# EAGLE schematic marbles_v70 (EAGLE 9.6.2)

## Sheet 1 of 5
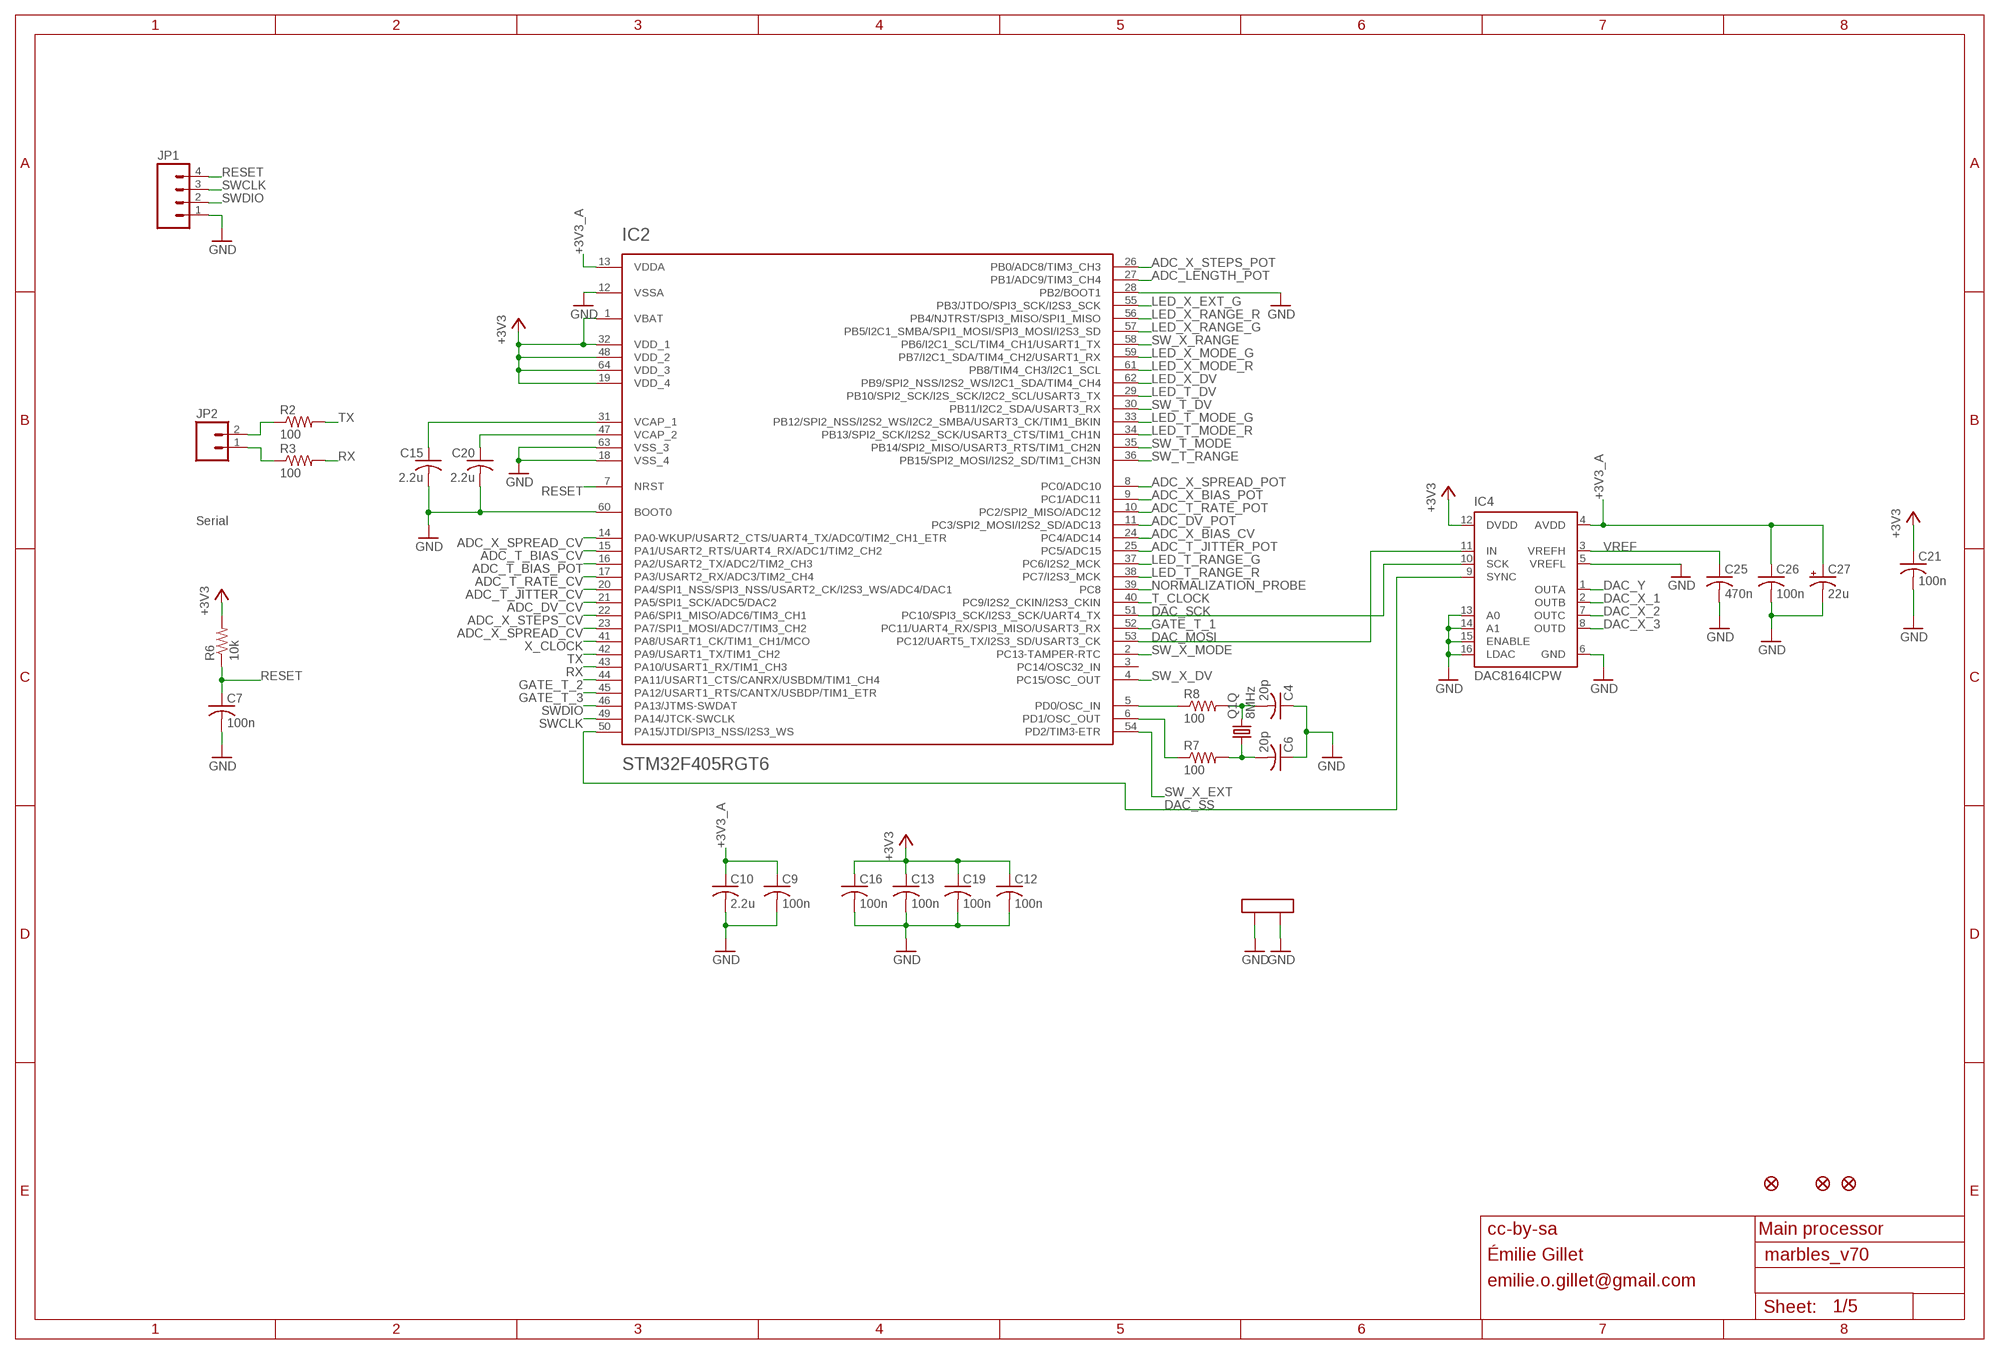
[diagram p0: schematic, sheet 1]

### Parts
C4  20p  C-USC0402  [C0402]
C6  20p  C-USC0402  [C0402]
C7  100n  C-USC0402  [C0402]
C9  100n  C-USC0402  [C0402]
C10  2.2u  C-USC0805  [C0805]
C12  100n  C-USC0402  [C0402]
C13  100n  C-USC0402  [C0402]
C15  2.2u  C-USC0805  [C0805]
C16  100n  C-USC0402  [C0402]
C19  100n  C-USC0402  [C0402]
C20  2.2u  C-USC0805  [C0805]
C21  100n  C-USC0402  [C0402]
C25  470n  C-USC0402  [C0402]
C26  100n  C-USC0402  [C0402]
C27  22u  CPOL-USC  [PANASONIC_C]
F1  FIDUCIAL1X2  [FIDUCIAL-1X2]
F2  FIDUCIAL1X2  [FIDUCIAL-1X2]
F3  FIDUCIAL1X2  [FIDUCIAL-1X2]
IC2  STM32F405RGT6  STM32F20X  [TQFP-10X10-64]
IC4  DAC8164ICPW  DAC8564  [SOP65P640X110-16N]
JP1  M04PTH  [1X04]
JP2  M02PTH  [1X02]
Q1  8MHz  CRYSTAL  [CTS406]
R2  100  R-US_R0402  [R0402]
R3  100  R-US_R0402  [R0402]
R6  10k  R-US_R0402  [R0402]
R7  100  R-US_R0402  [R0402]
R8  100  R-US_R0402  [R0402]

### Nets
+3V3: C12.1 C13.1 C16.1 C19.1 C21.1 IC2.1(VBAT) IC2.19(VDD_4) IC2.32(VDD_1) IC2.48(VDD_2) IC2.64(VDD_3) IC4.12(DVDD) R6.2 ; also sheet 3,5
+3V3_A: C9.1 C10.1 C26.1 C27.+ IC2.13(VDDA) IC4.4(AVDD) ; also sheet 2,3,5
ADC_DV_CV: IC2.21(PA5/SPI1_SCK/ADC5/DAC2) ; also sheet 3
ADC_DV_POT: IC2.11(PC3/SPI2_MOSI/I2S2_SD/ADC13) ; also sheet 2
ADC_LENGTH_POT: IC2.27(PB1/ADC9/TIM3_CH4) ; also sheet 2
ADC_T_BIAS_CV: IC2.15(PA1/USART2_RTS/UART4_RX/ADC1/TIM2_CH2) ; also sheet 3
ADC_T_BIAS_POT: IC2.16(PA2/USART2_TX/ADC2/TIM2_CH3) ; also sheet 2
ADC_T_JITTER_CV: IC2.20(PA4/SPI1_NSS/SPI3_NSS/USART2_CK/I2S3_WS/ADC4/DAC1) ; also sheet 3
ADC_T_JITTER_POT: IC2.25(PC5/ADC15) ; also sheet 2
ADC_T_RATE_CV: IC2.17(PA3/USART2_RX/ADC3/TIM2_CH4) ; also sheet 3
ADC_T_RATE_POT: IC2.10(PC2/SPI2_MISO/ADC12) ; also sheet 2
ADC_X_BIAS_CV: IC2.24(PC4/ADC14) ; also sheet 3
ADC_X_BIAS_POT: IC2.9(PC1/ADC11) ; also sheet 2
ADC_X_SPREAD_CV: IC2.14(PA0-WKUP/USART2_CTS/UART4_TX/ADC0/TIM2_CH1_ETR) IC2.23(PA7/SPI1_MOSI/ADC7/TIM3_CH2) ; also sheet 3
ADC_X_SPREAD_POT: IC2.8(PC0/ADC10) ; also sheet 2
ADC_X_STEPS_CV: IC2.22(PA6/SPI1_MISO/ADC6/TIM3_CH1) ; also sheet 3
ADC_X_STEPS_POT: IC2.26(PB0/ADC8/TIM3_CH3) ; also sheet 2
DAC_MOSI: IC2.53(PC12/UART5_TX/I2S3_SD/USART3_CK) IC4.11(IN)
DAC_SCK: IC2.51(PC10/SPI3_SCK/I2S3_SCK/UART4_TX) IC4.10(SCK)
DAC_SS: IC2.50(PA15/JTDI/SPI3_NSS/I2S3_WS) IC4.9(SYNC)
DAC_X_1: IC4.2(OUTB) ; also sheet 4
DAC_X_2: IC4.7(OUTC) ; also sheet 4
DAC_X_3: IC4.8(OUTD) ; also sheet 4
DAC_Y: IC4.1(OUTA) ; also sheet 4
GATE_T_1: IC2.52(PC11/UART4_RX/SPI3_MISO/USART3_RX) ; also sheet 4
GATE_T_2: IC2.44(PA11/USART1_CTS/CANRX/USBDM/TIM1_CH4) ; also sheet 4
GATE_T_3: IC2.45(PA12/USART1_RTS/CANTX/USBDP/TIM1_ETR) ; also sheet 4
GND: C4.1 C6.1 C7.2 C9.2 C10.2 C12.2 C13.2 C15.2 C16.2 C19.2 C20.2 C21.2 C25.2 C26.2 C27.- IC2.12(VSSA) IC2.18(VSS_4) IC2.28(PB2/BOOT1) IC2.60(BOOT0) IC2.63(VSS_3) IC4.5(VREFL) IC4.6(GND) IC4.13(A0) IC4.14(A1) IC4.15(ENABLE) IC4.16(LDAC) JP1.1 Q1.2(LID1) Q1.4(LID2) ; also sheet 2,3,4,5
LED_T_DV: IC2.29(PB10/SPI2_SCK/I2S_SCK/I2C2_SCL/USART3_TX) ; also sheet 2
LED_T_MODE_G: IC2.33(PB12/SPI2_NSS/I2S2_WS/I2C2_SMBA/USART3_CK/TIM1_BKIN) ; also sheet 2
LED_T_MODE_R: IC2.34(PB13/SPI2_SCK/I2S2_SCK/USART3_CTS/TIM1_CH1N) ; also sheet 2
LED_T_RANGE_G: IC2.37(PC6/I2S2_MCK) ; also sheet 2
LED_T_RANGE_R: IC2.38(PC7/I2S3_MCK) ; also sheet 2
LED_X_DV: IC2.62(PB9/SPI2_NSS/I2S2_WS/I2C1_SDA/TIM4_CH4) ; also sheet 2
LED_X_EXT_G: IC2.55(PB3/JTDO/SPI3_SCK/I2S3_SCK) ; also sheet 2
LED_X_MODE_G: IC2.59(PB7/I2C1_SDA/TIM4_CH2/USART1_RX) ; also sheet 2
LED_X_MODE_R: IC2.61(PB8/TIM4_CH3/I2C1_SCL) ; also sheet 2
LED_X_RANGE_G: IC2.57(PB5/I2C1_SMBA/SPI1_MOSI/SPI3_MOSI/I2S3_SD) ; also sheet 2
LED_X_RANGE_R: IC2.56(PB4/NJTRST/SPI3_MISO/SPI1_MISO) ; also sheet 2
N$7: IC2.6(PD1/OSC_OUT) R7.1
N$8: IC2.5(PD0/OSC_IN) R8.1
N$13: C20.1 IC2.47(VCAP_2)
N$19: C15.1 IC2.31(VCAP_1)
N$33: JP2.2 R2.1
N$51: JP2.1 R3.1
N$62: C4.2 Q1.3 R8.2
N$65: C6.2 Q1.1 R7.2
NORMALIZATION_PROBE: IC2.39(PC8) ; also sheet 3
RESET: C7.1 IC2.7(NRST) JP1.4 R6.1
RX: IC2.43(PA10/USART1_RX/TIM1_CH3) R3.2
SW_T_DV: IC2.30(PB11/I2C2_SDA/USART3_RX) ; also sheet 2
SW_T_MODE: IC2.35(PB14/SPI2_MISO/USART3_RTS/TIM1_CH2N) ; also sheet 2
SW_T_RANGE: IC2.36(PB15/SPI2_MOSI/I2S2_SD/TIM1_CH3N) ; also sheet 2
SW_X_DV: IC2.4(PC15/OSC_OUT) ; also sheet 2
SW_X_EXT: IC2.54(PD2/TIM3-ETR) ; also sheet 2
SW_X_MODE: IC2.2(PC13-TAMPER-RTC) ; also sheet 2
SW_X_RANGE: IC2.58(PB6/I2C1_SCL/TIM4_CH1/USART1_TX) ; also sheet 2
SWCLK: IC2.49(PA14/JTCK-SWCLK) JP1.3
SWDIO: IC2.46(PA13/JTMS-SWDAT) JP1.2
T_CLOCK: IC2.40(PC9/I2S2_CKIN/I2S3_CKIN) ; also sheet 3
TX: IC2.42(PA9/USART1_TX/TIM1_CH2) R2.2
VREF: C25.1 IC4.3(VREFH) ; also sheet 4
X_CLOCK: IC2.41(PA8/USART1_CK/TIM1_CH1/MCO) ; also sheet 3
Unconnected: IC2.3(PC14/OSC32_IN)

### Notes on the sheet
- Serial
- cc-by-sa | Main processor
- Émilie Gillet
- emilie.o.gillet@gmail.com

## Sheet 2 of 5
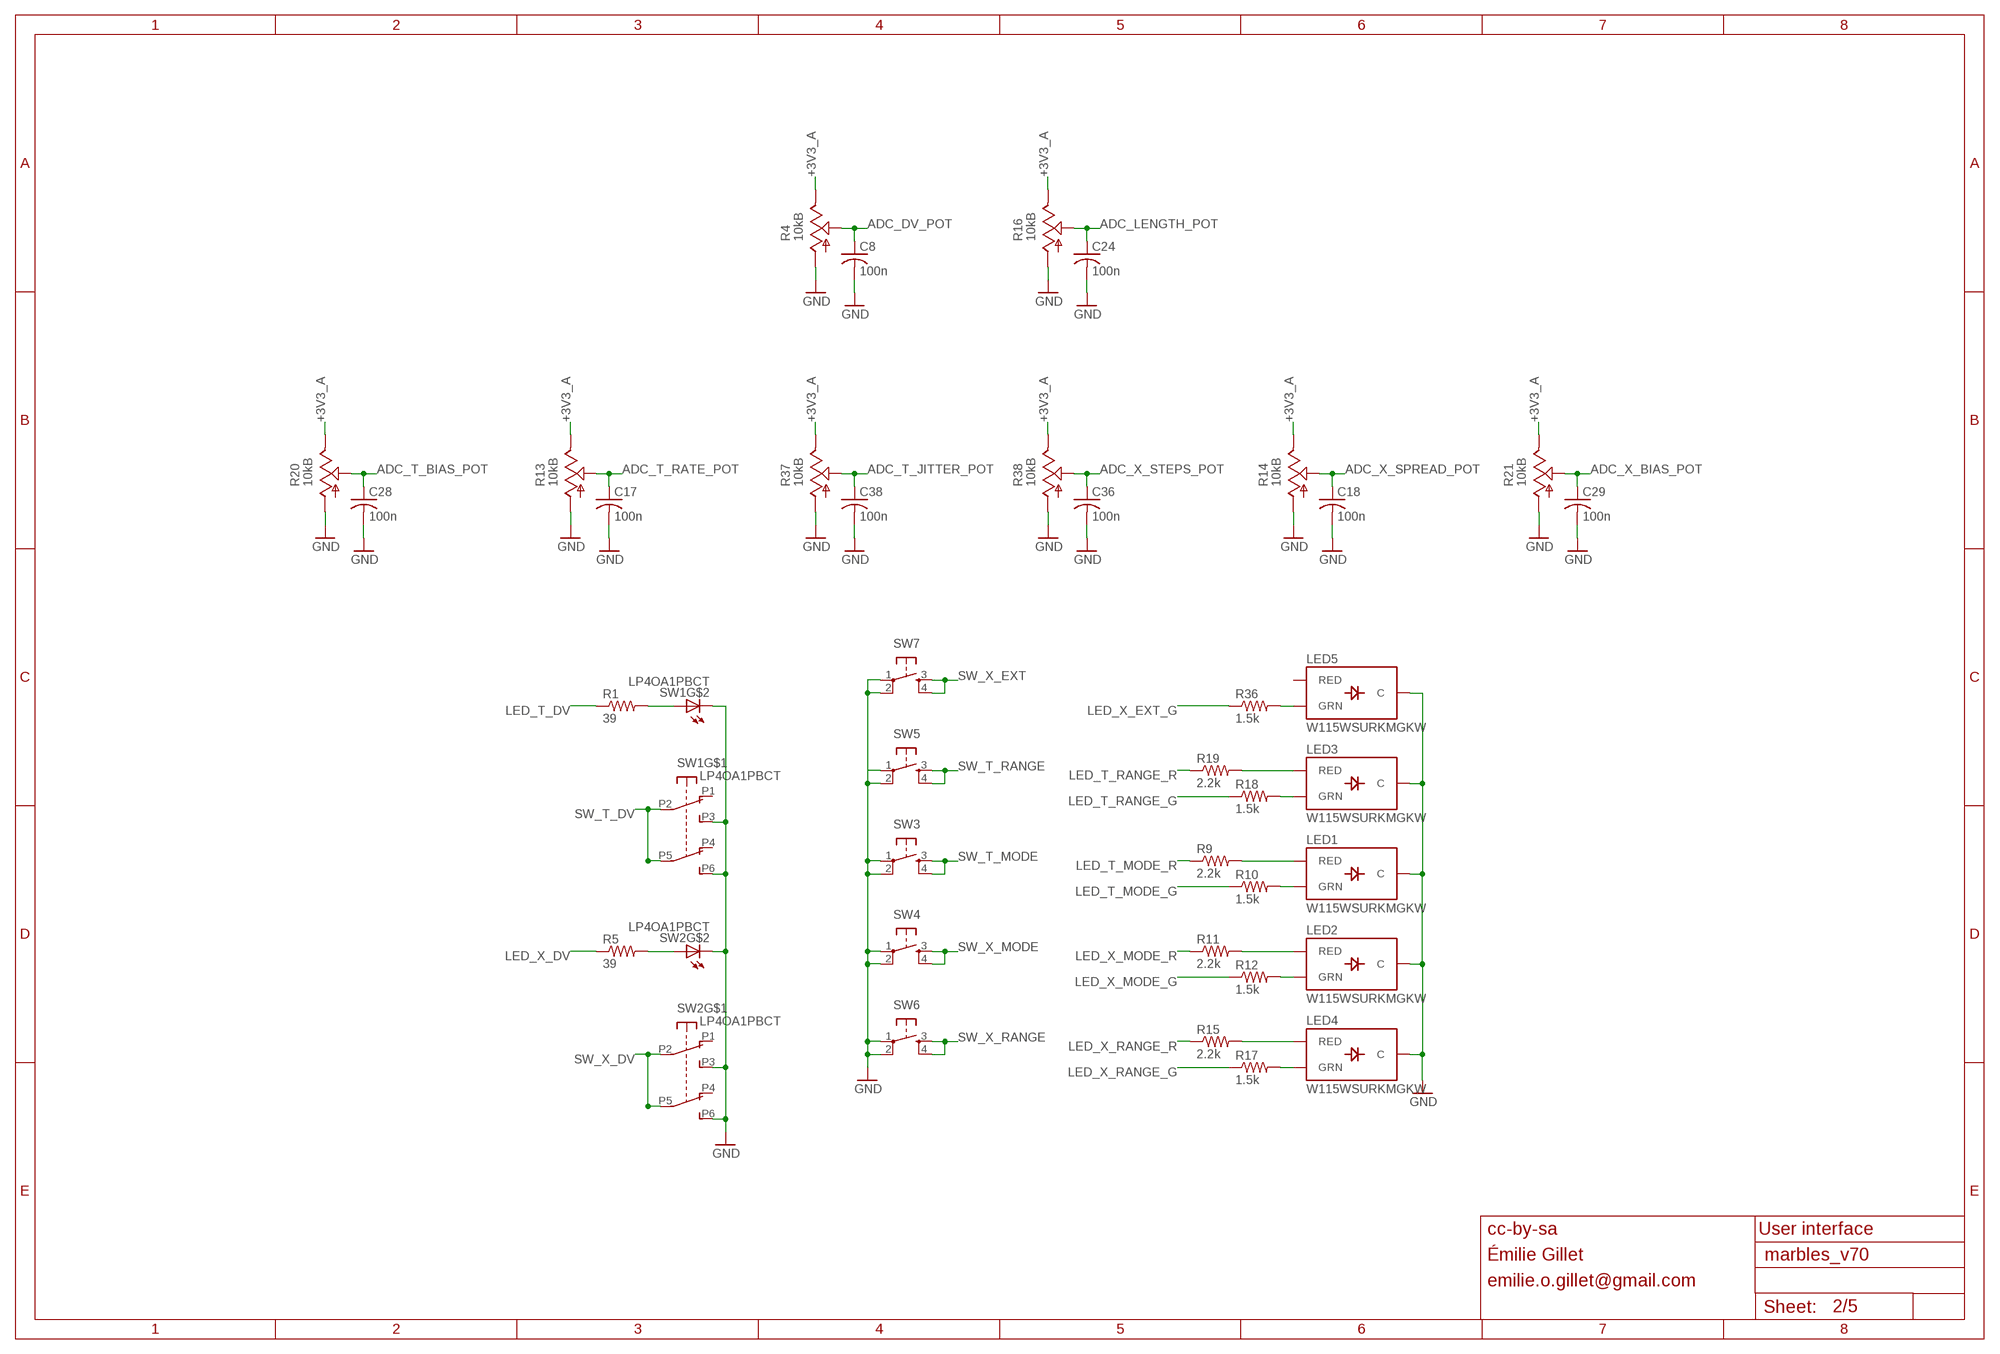
[diagram p1: schematic, sheet 2]

### Parts
C8  100n  C-USC0402  [C0402]
C17  100n  C-USC0402  [C0402]
C18  100n  C-USC0402  [C0402]
C24  100n  C-USC0402  [C0402]
C28  100n  C-USC0402  [C0402]
C29  100n  C-USC0402  [C0402]
C36  100n  C-USC0402  [C0402]
C38  100n  C-USC0402  [C0402]
LED1  W115WSURKMGKW  LED-BICOLOR-THROUGHHOLE2.54  [LED-BICOLOR-THROUGHHOLE-2.54]
LED2  W115WSURKMGKW  LED-BICOLOR-THROUGHHOLE2.54  [LED-BICOLOR-THROUGHHOLE-2.54]
LED3  W115WSURKMGKW  LED-BICOLOR-THROUGHHOLE2.54  [LED-BICOLOR-THROUGHHOLE-2.54]
LED4  W115WSURKMGKW  LED-BICOLOR-THROUGHHOLE2.54  [LED-BICOLOR-THROUGHHOLE-2.54]
LED5  W115WSURKMGKW  LED-BICOLOR-THROUGHHOLE2.54  [LED-BICOLOR-THROUGHHOLE-2.54]
R1  39  R-US_R0402  [R0402]
R4  10kB  POT_USVERTICAL_PS  [ALPS_POT_VERTICAL_PS]
R5  39  R-US_R0402  [R0402]
R9  2.2k  R-US_R0402  [R0402]
R10  1.5k  R-US_R0402  [R0402]
R11  2.2k  R-US_R0402  [R0402]
R12  1.5k  R-US_R0402  [R0402]
R13  10kB  POT_USVERTICAL_PS  [ALPS_POT_VERTICAL_PS]
R14  10kB  POT_USVERTICAL_PS  [ALPS_POT_VERTICAL_PS]
R15  2.2k  R-US_R0402  [R0402]
R16  10kB  POT_USVERTICAL_PS  [ALPS_POT_VERTICAL_PS]
R17  1.5k  R-US_R0402  [R0402]
R18  1.5k  R-US_R0402  [R0402]
R19  2.2k  R-US_R0402  [R0402]
R20  10kB  POT_USVERTICAL_PS  [ALPS_POT_VERTICAL_PS]
R21  10kB  POT_USVERTICAL_PS  [ALPS_POT_VERTICAL_PS]
R36  1.5k  R-US_R0402  [R0402]
R37  10kB  POT_USVERTICAL_PS  [ALPS_POT_VERTICAL_PS]
R38  10kB  POT_USVERTICAL_PS  [ALPS_POT_VERTICAL_PS]
SW1  LP4OA1PBCT  [LP4OA1PBCT]
SW2  LP4OA1PBCT  [LP4OA1PBCT]
SW3  TAC_SWITCHPTH  [TACTILE-PTH]
SW4  TAC_SWITCHPTH  [TACTILE-PTH]
SW5  TAC_SWITCHPTH  [TACTILE-PTH]
SW6  TAC_SWITCHPTH  [TACTILE-PTH]
SW7  TAC_SWITCHPTH  [TACTILE-PTH]

### Nets
+3V3_A: R4.P$1(E) R13.P$1(E) R14.P$1(E) R16.P$1(E) R20.P$1(E) R21.P$1(E) R37.P$1(E) R38.P$1(E) ; also sheet 1,3,5
ADC_DV_POT: C8.1 R4.P$2(S) ; also sheet 1
ADC_LENGTH_POT: C24.1 R16.P$2(S) ; also sheet 1
ADC_T_BIAS_POT: C28.1 R20.P$2(S) ; also sheet 1
ADC_T_JITTER_POT: C38.1 R37.P$2(S) ; also sheet 1
ADC_T_RATE_POT: C17.1 R13.P$2(S) ; also sheet 1
ADC_X_BIAS_POT: C29.1 R21.P$2(S) ; also sheet 1
ADC_X_SPREAD_POT: C18.1 R14.P$2(S) ; also sheet 1
ADC_X_STEPS_POT: C36.1 R38.P$2(S) ; also sheet 1
GND: C8.2 C17.2 C18.2 C24.2 C28.2 C29.2 C36.2 C38.2 LED1.2(C) LED2.2(C) LED3.2(C) LED4.2(C) LED5.2(C) R4.P$3(A) R13.P$3(A) R14.P$3(A) R16.P$3(A) R20.P$3(A) R21.P$3(A) R37.P$3(A) R38.P$3(A) SW1.L2 SW1.P3(A3) SW1.P6(B3) SW2.L2 SW2.P3(A3) SW2.P6(B3) SW3.1 SW3.2 SW4.1 SW4.2 SW5.1 SW5.2 SW6.1 SW6.2 SW7.1 SW7.2 ; also sheet 1,3,4,5
LED_T_DV: R1.1 ; also sheet 1
LED_T_MODE_G: R10.1 ; also sheet 1
LED_T_MODE_R: R9.1 ; also sheet 1
LED_T_RANGE_G: R18.1 ; also sheet 1
LED_T_RANGE_R: R19.1 ; also sheet 1
LED_X_DV: R5.1 ; also sheet 1
LED_X_EXT_G: R36.1 ; also sheet 1
LED_X_MODE_G: R12.1 ; also sheet 1
LED_X_MODE_R: R11.1 ; also sheet 1
LED_X_RANGE_G: R17.1 ; also sheet 1
LED_X_RANGE_R: R15.1 ; also sheet 1
N$1: R1.2 SW1.L1
N$2: R5.2 SW2.L1
N$9: LED3.3(RED) R19.2
N$12: LED3.1(GRN) R18.2
N$16: LED1.3(RED) R9.2
N$18: LED2.3(RED) R11.2
N$20: LED2.1(GRN) R12.2
N$21: LED4.3(RED) R15.2
N$22: LED1.1(GRN) R10.2
N$23: LED4.1(GRN) R17.2
N$42: LED5.1(GRN) R36.2
SW_T_DV: SW1.P2(A2) SW1.P5(B2) ; also sheet 1
SW_T_MODE: SW3.3 SW3.4 ; also sheet 1
SW_T_RANGE: SW5.3 SW5.4 ; also sheet 1
SW_X_DV: SW2.P2(A2) SW2.P5(B2) ; also sheet 1
SW_X_EXT: SW7.3 SW7.4 ; also sheet 1
SW_X_MODE: SW4.3 SW4.4 ; also sheet 1
SW_X_RANGE: SW6.3 SW6.4 ; also sheet 1
Unconnected: LED5.3(RED) SW1.P1(A1) SW1.P4(B1) SW2.P1(A1) SW2.P4(B1)

### Notes on the sheet
- cc-by-sa | User interface
- Émilie Gillet
- emilie.o.gillet@gmail.com

## Sheet 3 of 5
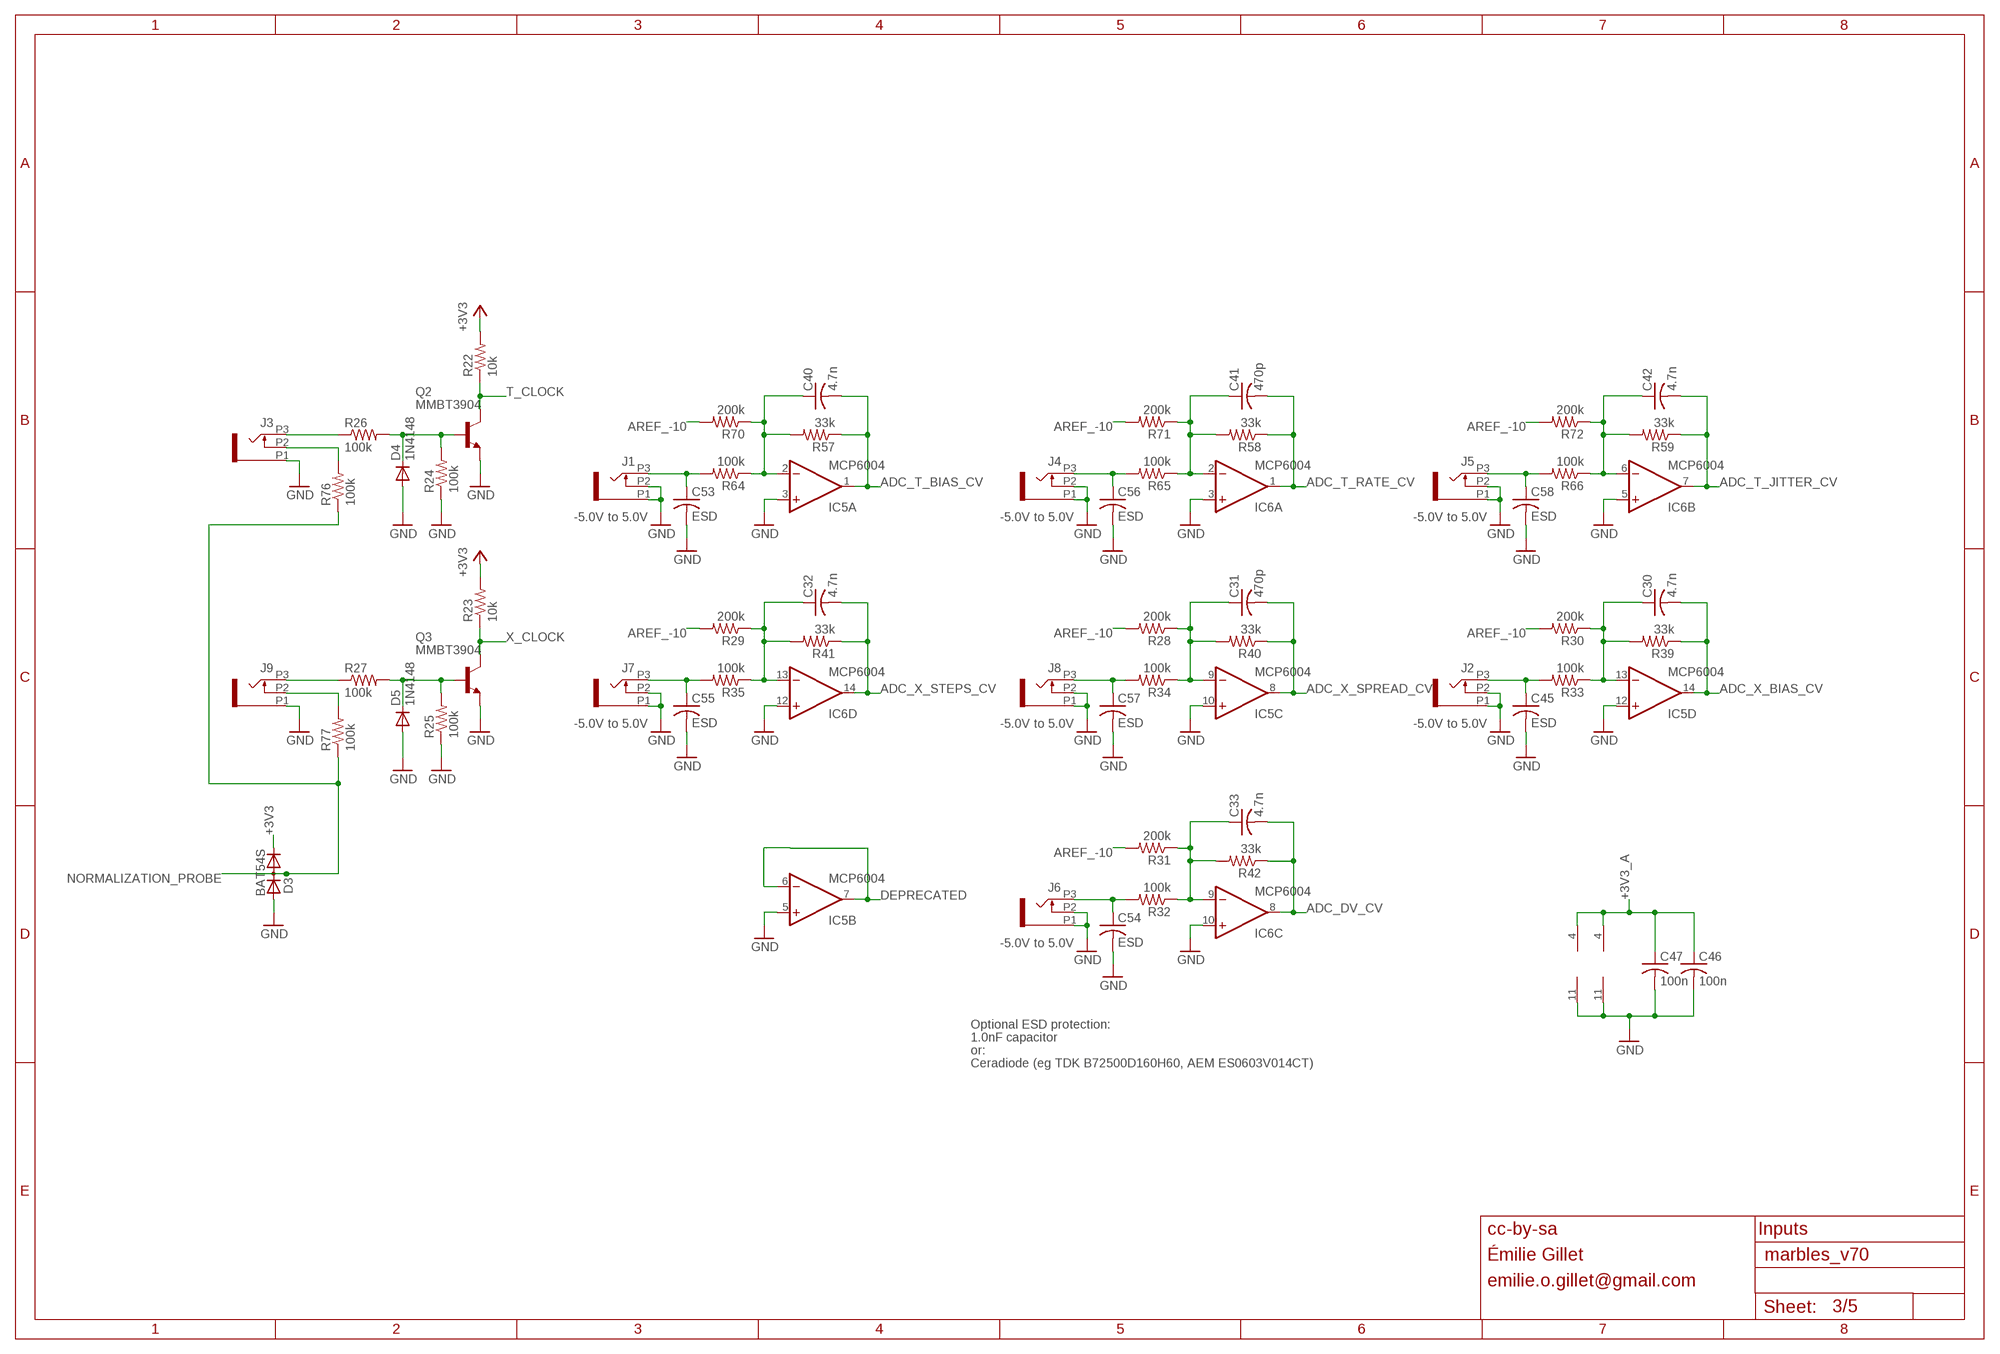
[diagram p2: schematic, sheet 3]

### Parts
C30  4.7n  C-USC0402  [C0402]
C31  470p  C-USC0402  [C0402]
C32  4.7n  C-USC0402  [C0402]
C33  4.7n  C-USC0402  [C0402]
C40  4.7n  C-USC0402  [C0402]
C41  470p  C-USC0402  [C0402]
C42  4.7n  C-USC0402  [C0402]
C45  ESD  C-USC0603  [C0603]
C46  100n  C-USC0402  [C0402]
C47  100n  C-USC0402  [C0402]
C53  ESD  C-USC0603  [C0603]
C54  ESD  C-USC0603  [C0603]
C55  ESD  C-USC0603  [C0603]
C56  ESD  C-USC0603  [C0603]
C57  ESD  C-USC0603  [C0603]
C58  ESD  C-USC0603  [C0603]
D3  BAT54S  DIODE_2CACA-SOT23  [SOT23]
D4  1N4148  DIODE-SOD523  [SOD523]
D5  1N4148  DIODE-SOD523  [SOD523]
IC5  MCP6004  TL074PW  [TSSOP14_065]
IC6  MCP6004  TL074PW  [TSSOP14_065]
J1  PJ301_THONKICONN6  [WQP_PJ_301M6]
J2  PJ301_THONKICONN6  [WQP_PJ_301M6]
J3  PJ301_THONKICONN6  [WQP_PJ_301M6]
J4  PJ301_THONKICONN6  [WQP_PJ_301M6]
J5  PJ301_THONKICONN6  [WQP_PJ_301M6]
J6  PJ301_THONKICONN6  [WQP_PJ_301M6]
J7  PJ301_THONKICONN6  [WQP_PJ_301M6]
J8  PJ301_THONKICONN6  [WQP_PJ_301M6]
J9  PJ301_THONKICONN6  [WQP_PJ_301M6]
Q2  MMBT3904  MMBT3904LT1-NPN-SOT23-BEC  [SOT23-BEC]
Q3  MMBT3904  MMBT3904LT1-NPN-SOT23-BEC  [SOT23-BEC]
R22  10k  R-US_R0402  [R0402]
R23  10k  R-US_R0402  [R0402]
R24  100k  R-US_R0402  [R0402]
R25  100k  R-US_R0402  [R0402]
R26  100k  R-US_R0402  [R0402]
R27  100k  R-US_R0402  [R0402]
R28  200k  R-US_R0402  [R0402]
R29  200k  R-US_R0402  [R0402]
R30  200k  R-US_R0402  [R0402]
R31  200k  R-US_R0402  [R0402]
R32  100k  R-US_R0402  [R0402]
R33  100k  R-US_R0402  [R0402]
R34  100k  R-US_R0402  [R0402]
R35  100k  R-US_R0402  [R0402]
R39  33k  R-US_R0402  [R0402]
R40  33k  R-US_R0402  [R0402]
R41  33k  R-US_R0402  [R0402]
R42  33k  R-US_R0402  [R0402]
R57  33k  R-US_R0402  [R0402]
R58  33k  R-US_R0402  [R0402]
R59  33k  R-US_R0402  [R0402]
R64  100k  R-US_R0402  [R0402]
R65  100k  R-US_R0402  [R0402]
R66  100k  R-US_R0402  [R0402]
R70  200k  R-US_R0402  [R0402]
R71  200k  R-US_R0402  [R0402]
R72  200k  R-US_R0402  [R0402]
R76  100k  R-US_R0402  [R0402]
R77  100k  R-US_R0402  [R0402]

### Nets
+3V3: D3.2(C) R22.2 R23.2 ; also sheet 1,5
+3V3_A: C46.1 C47.1 IC5.4(P:V+) IC6.4(P:V+) ; also sheet 1,2,5
ADC_DV_CV: C33.2 IC6.8(C:OUT) R42.1 ; also sheet 1
ADC_T_BIAS_CV: C40.2 IC5.1(A:OUT) R57.1 ; also sheet 1
ADC_T_JITTER_CV: C42.2 IC6.7(B:OUT) R59.1 ; also sheet 1
ADC_T_RATE_CV: C41.2 IC6.1(A:OUT) R58.1 ; also sheet 1
ADC_X_BIAS_CV: C30.2 IC5.14(D:OUT) R39.1 ; also sheet 1
ADC_X_SPREAD_CV: C31.2 IC5.8(C:OUT) R40.1 ; also sheet 1
ADC_X_STEPS_CV: C32.2 IC6.14(D:OUT) R41.1 ; also sheet 1
AREF_-10: R28.2 R29.2 R30.2 R31.2 R70.2 R71.2 R72.2 ; also sheet 5
DEPRECATED: IC5.6(B:-IN) IC5.7(B:OUT)
GND: C45.2 C46.2 C47.2 C53.2 C54.2 C55.2 C56.2 C57.2 C58.2 D3.1(A) D4.A D5.A IC5.3(A:+IN) IC5.5(B:+IN) IC5.10(C:+IN) IC5.11(P:V-) IC5.12(D:+IN) IC6.3(A:+IN) IC6.5(B:+IN) IC6.10(C:+IN) IC6.11(P:V-) IC6.12(D:+IN) J1.P1 J1.P2 J2.P1 J2.P2 J3.P1 J4.P1 J4.P2 J5.P1 J5.P2 J6.P1 J6.P2 J7.P1 J7.P2 J8.P1 J8.P2 J9.P1 Q2.E Q3.E R24.1 R25.1 ; also sheet 1,2,4,5
MORPH_IN: C53.1 J1.P3 R64.2
MORPH_IN1: C55.1 J7.P3 R35.2
MORPH_IN3: C56.1 J4.P3 R65.2
MORPH_IN4: C57.1 J8.P3 R34.2
MORPH_IN5: C54.1 J6.P3 R32.2
MORPH_IN6: C58.1 J5.P3 R66.2
MORPH_IN7: C45.1 J2.P3 R33.2
N$5: C41.1 IC6.2(A:-IN) R58.2 R65.1 R71.1
N$11: C40.1 IC5.2(A:-IN) R57.2 R64.1 R70.1
N$15: C42.1 IC6.6(B:-IN) R59.2 R66.1 R72.1
N$17: C31.1 IC5.9(C:-IN) R28.1 R34.1 R40.2
N$25: C30.1 IC5.13(D:-IN) R30.1 R33.1 R39.2
N$27: C32.1 IC6.13(D:-IN) R29.1 R35.1 R41.2
N$31: C33.1 IC6.9(C:-IN) R31.1 R32.1 R42.2
N$36: J9.P3 R27.1
N$46: J9.P2 R77.2
N$47: J3.P2 R76.2
N$50: D4.C Q2.B R24.2 R26.2
N$52: D5.C Q3.B R25.2 R27.2
N$57: J3.P3 R26.1
NORMALIZATION_PROBE: D3.3(AC) R76.1 R77.1 ; also sheet 1
T_CLOCK: Q2.C R22.1 ; also sheet 1
X_CLOCK: Q3.C R23.1 ; also sheet 1

### Notes on the sheet
- -5.0V to 5.0V | -5.0V to 5.0V | -5.0V to 5.0V
- -5.0V to 5.0V | -5.0V to 5.0V | -5.0V to 5.0V
- -5.0V to 5.0V
- Optional ESD protection:
- 1.0nF capacitor
- or:
- Ceradiode (eg TDK B72500D160H60, AEM ES0603V014CT)
- cc-by-sa | Inputs
- Émilie Gillet
- emilie.o.gillet@gmail.com

## Sheet 4 of 5
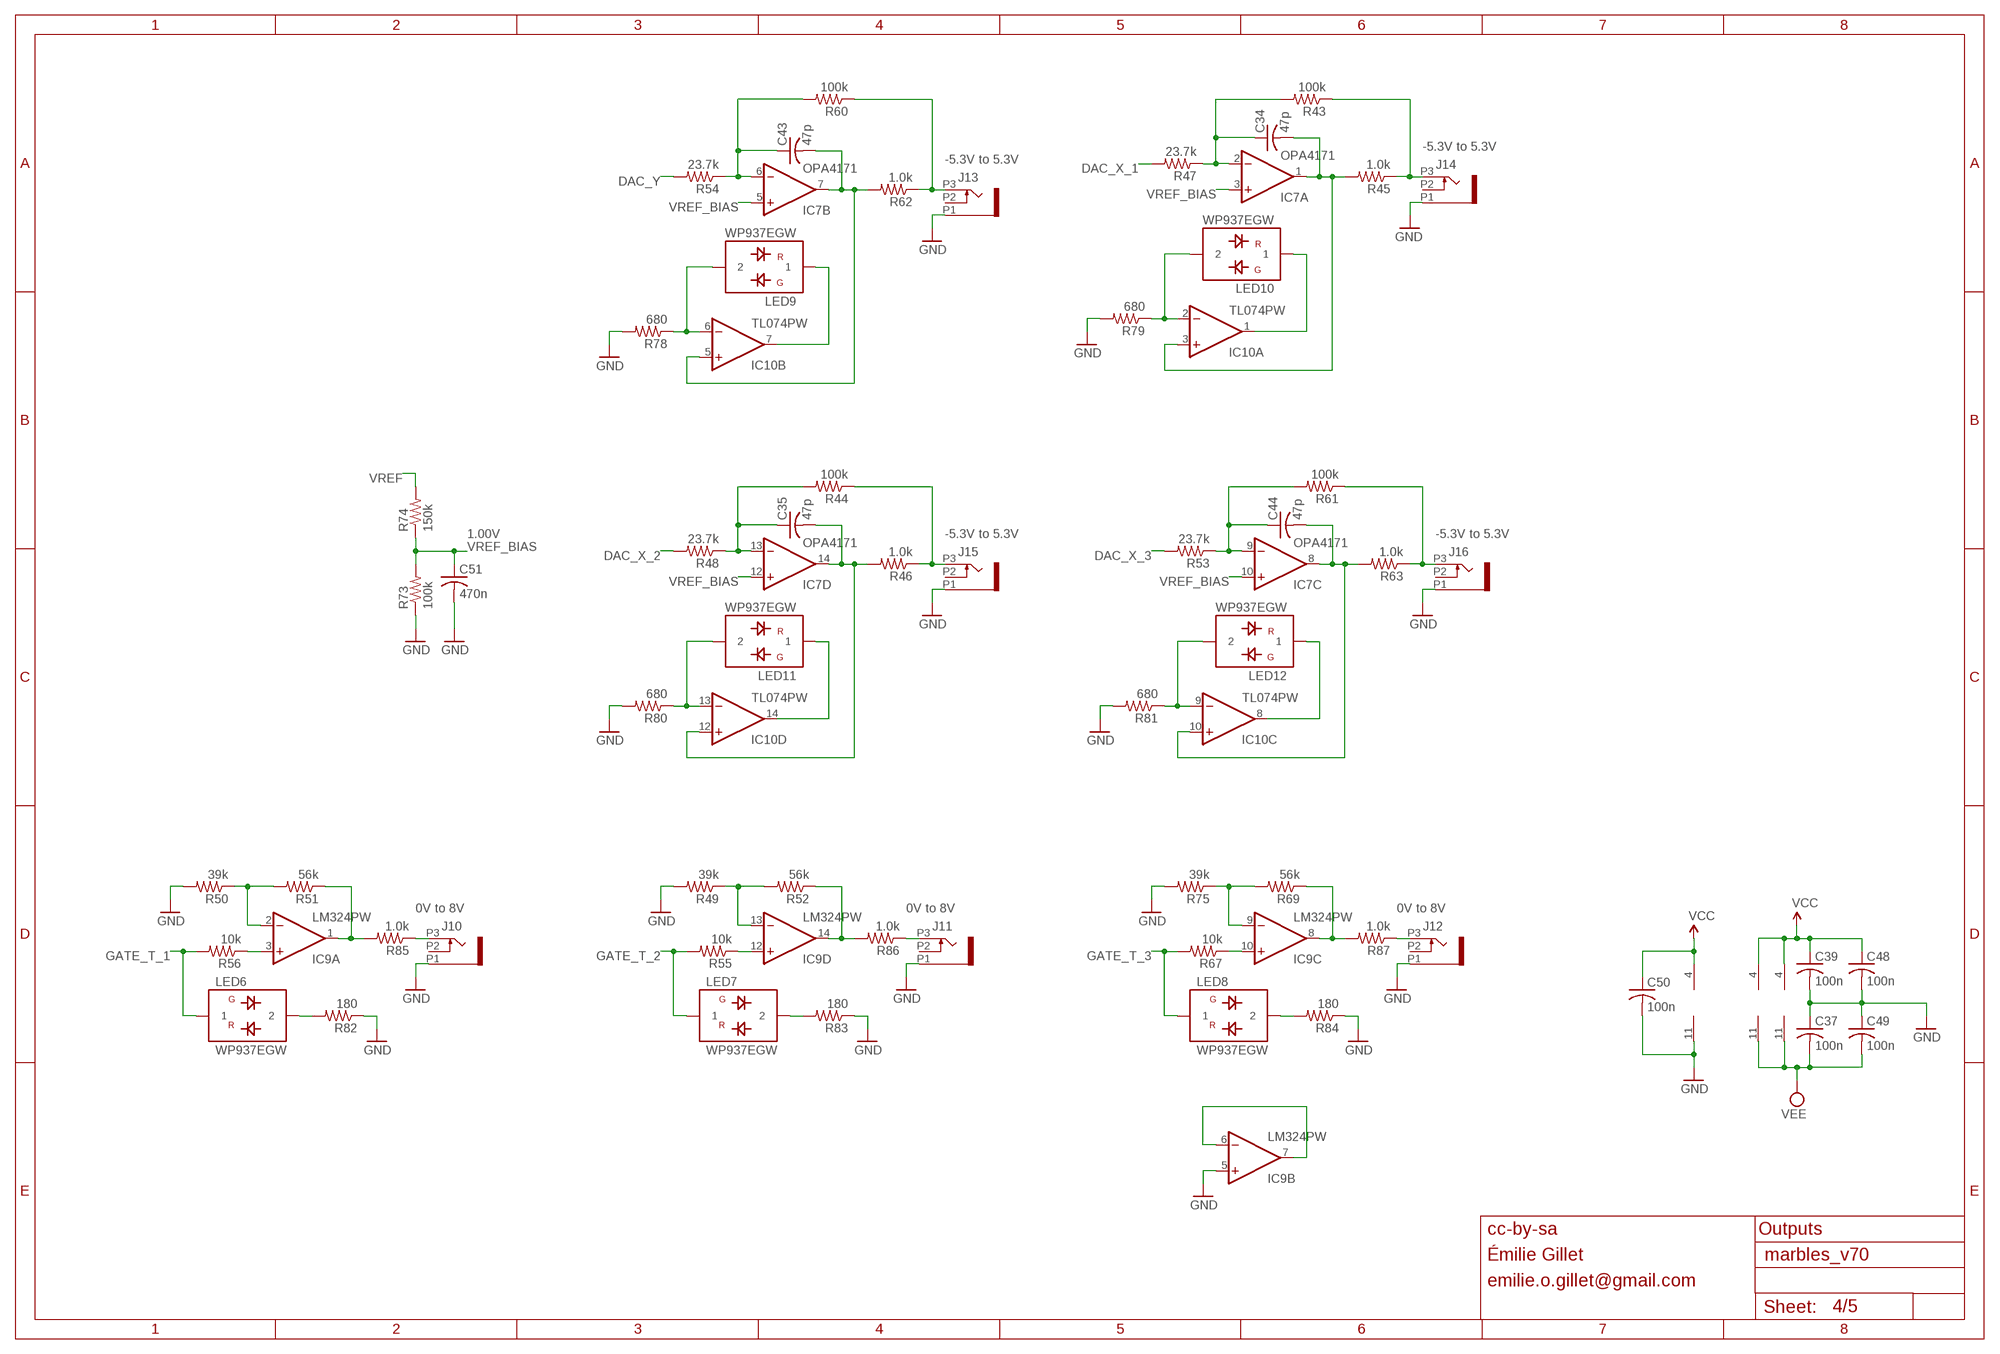
[diagram p3: schematic, sheet 4]

### Parts
C34  47p  C-USC0402  [C0402]
C35  47p  C-USC0402  [C0402]
C37  100n  C-USC0402  [C0402]
C39  100n  C-USC0402  [C0402]
C43  47p  C-USC0402  [C0402]
C44  47p  C-USC0402  [C0402]
C48  100n  C-USC0402  [C0402]
C49  100n  C-USC0402  [C0402]
C50  100n  C-USC0402  [C0402]
C51  470n  C-USC0402  [C0402]
IC7  OPA4171  TL074PW  [TSSOP14_065]
IC9  LM324PW  TL074PW  [TSSOP14_065]
IC10  TL074PW  [TSSOP14_065]
J10  PJ301_THONKICONN6  [WQP_PJ_301M6]
J11  PJ301_THONKICONN6  [WQP_PJ_301M6]
J12  PJ301_THONKICONN6  [WQP_PJ_301M6]
J13  PJ301_THONKICONN6  [WQP_PJ_301M6]
J14  PJ301_THONKICONN6  [WQP_PJ_301M6]
J15  PJ301_THONKICONN6  [WQP_PJ_301M6]
J16  PJ301_THONKICONN6  [WQP_PJ_301M6]
LED6  WP937EGW  LED-BICOLOR-SHARED-THROUGHHOLE  [LED3MM]
LED7  WP937EGW  LED-BICOLOR-SHARED-THROUGHHOLE  [LED3MM]
LED8  WP937EGW  LED-BICOLOR-SHARED-THROUGHHOLE  [LED3MM]
LED9  WP937EGW  LED-BICOLOR-SHARED-THROUGHHOLE  [LED3MM]
LED10  WP937EGW  LED-BICOLOR-SHARED-THROUGHHOLE  [LED3MM]
LED11  WP937EGW  LED-BICOLOR-SHARED-THROUGHHOLE  [LED3MM]
LED12  WP937EGW  LED-BICOLOR-SHARED-THROUGHHOLE  [LED3MM]
R43  100k  R-US_R0402  [R0402]
R44  100k  R-US_R0402  [R0402]
R45  1.0k  R-US_R0603  [R0603]
R46  1.0k  R-US_R0603  [R0603]
R47  23.7k  R-US_R0402  [R0402]
R48  23.7k  R-US_R0402  [R0402]
R49  39k  R-US_R0402  [R0402]
R50  39k  R-US_R0402  [R0402]
R51  56k  R-US_R0402  [R0402]
R52  56k  R-US_R0402  [R0402]
R53  23.7k  R-US_R0402  [R0402]
R54  23.7k  R-US_R0402  [R0402]
R55  10k  R-US_R0402  [R0402]
R56  10k  R-US_R0402  [R0402]
R60  100k  R-US_R0402  [R0402]
R61  100k  R-US_R0402  [R0402]
R62  1.0k  R-US_R0603  [R0603]
R63  1.0k  R-US_R0603  [R0603]
R67  10k  R-US_R0402  [R0402]
R69  56k  R-US_R0402  [R0402]
R73  100k  R-US_R0402  [R0402]
R74  150k  R-US_R0402  [R0402]
R75  39k  R-US_R0402  [R0402]
R78  680  R-US_R0402  [R0402]
R79  680  R-US_R0402  [R0402]
R80  680  R-US_R0402  [R0402]
R81  680  R-US_R0402  [R0402]
R82  180  R-US_R0402  [R0402]
R83  180  R-US_R0402  [R0402]
R84  180  R-US_R0402  [R0402]
R85  1.0k  R-US_R0603  [R0603]
R86  1.0k  R-US_R0603  [R0603]
R87  1.0k  R-US_R0603  [R0603]

### Nets
DAC_X_1: R47.2 ; also sheet 1
DAC_X_2: R48.2 ; also sheet 1
DAC_X_3: R53.2 ; also sheet 1
DAC_Y: R54.2 ; also sheet 1
GATE_T_1: LED6.1 R56.2 ; also sheet 1
GATE_T_2: LED7.1 R55.2 ; also sheet 1
GATE_T_3: LED8.1 R67.2 ; also sheet 1
GND: C37.1 C39.2 C48.2 C49.1 C50.2 C51.2 IC9.5(B:+IN) IC9.11(P:V-) J10.P1 J11.P1 J12.P1 J13.P1 J14.P1 J15.P1 J16.P1 R49.2 R50.2 R73.1 R75.2 R78.2 R79.2 R80.2 R81.2 R82.1 R83.1 R84.1 ; also sheet 1,2,3,5
N$3: IC9.12(D:+IN) R55.1
N$14: IC9.1(A:OUT) R51.1 R85.2
N$24: J10.P3 R85.1
N$26: IC9.2(A:-IN) R50.1 R51.2
N$28: LED6.2 R82.2
N$29: IC9.3(A:+IN) R56.1
N$30: IC9.6(B:-IN) IC9.7(B:OUT)
N$34: IC9.14(D:OUT) R52.1 R86.2
N$35: IC9.13(D:-IN) R49.1 R52.2
N$37: IC9.10(C:+IN) R67.1
N$38: IC9.8(C:OUT) R69.1 R87.2
N$39: J11.P3 R86.1
N$40: J12.P3 R87.1
N$41: IC9.9(C:-IN) R69.2 R75.1
N$44: LED7.2 R83.2
N$45: C43.2 IC7.7(B:OUT) IC10.5(B:+IN) R62.2
N$48: LED8.2 R84.2
N$49: J15.P3 R44.1 R46.1
N$53: J13.P3 R60.1 R62.1
N$54: C35.1 IC7.13(D:-IN) R44.2 R48.1
N$58: J16.P3 R61.1 R63.1
N$59: C44.1 IC7.9(C:-IN) R53.1 R61.2
N$60: C34.1 IC7.2(A:-IN) R43.2 R47.1
N$61: C43.1 IC7.6(B:-IN) R54.1 R60.2
N$63: J14.P3 R43.1 R45.1
N$67: IC10.6(B:-IN) LED9.2 R78.1
N$68: IC10.7(B:OUT) LED9.1
N$70: C34.2 IC7.1(A:OUT) IC10.3(A:+IN) R45.2
N$71: IC10.2(A:-IN) LED10.2 R79.1
N$72: IC10.1(A:OUT) LED10.1
N$73: C35.2 IC7.14(D:OUT) IC10.12(D:+IN) R46.2
N$74: IC10.13(D:-IN) LED11.2 R80.1
N$75: IC10.14(D:OUT) LED11.1
N$76: C44.2 IC7.8(C:OUT) IC10.10(C:+IN) R63.2
N$77: IC10.9(C:-IN) LED12.2 R81.1
N$78: IC10.8(C:OUT) LED12.1
VCC: C39.1 C48.1 C50.1 IC7.4(P:V+) IC9.4(P:V+) IC10.4(P:V+) ; also sheet 5
VEE: C37.2 C49.2 IC7.11(P:V-) IC10.11(P:V-) ; also sheet 5
VREF: R74.2 ; also sheet 1
VREF_BIAS: C51.1 IC7.3(A:+IN) IC7.5(B:+IN) IC7.10(C:+IN) IC7.12(D:+IN) R73.2 R74.1
Unconnected: J10.P2 J11.P2 J12.P2 J13.P2 J14.P2 J15.P2 J16.P2

### Notes on the sheet
- -5.3V to 5.3V
- -5.3V to 5.3V
- 1.00V | -5.3V to 5.3V | -5.3V to 5.3V
- 0V to 8V | 0V to 8V | 0V to 8V
- cc-by-sa | Outputs
- Émilie Gillet
- emilie.o.gillet@gmail.com

## Sheet 5 of 5
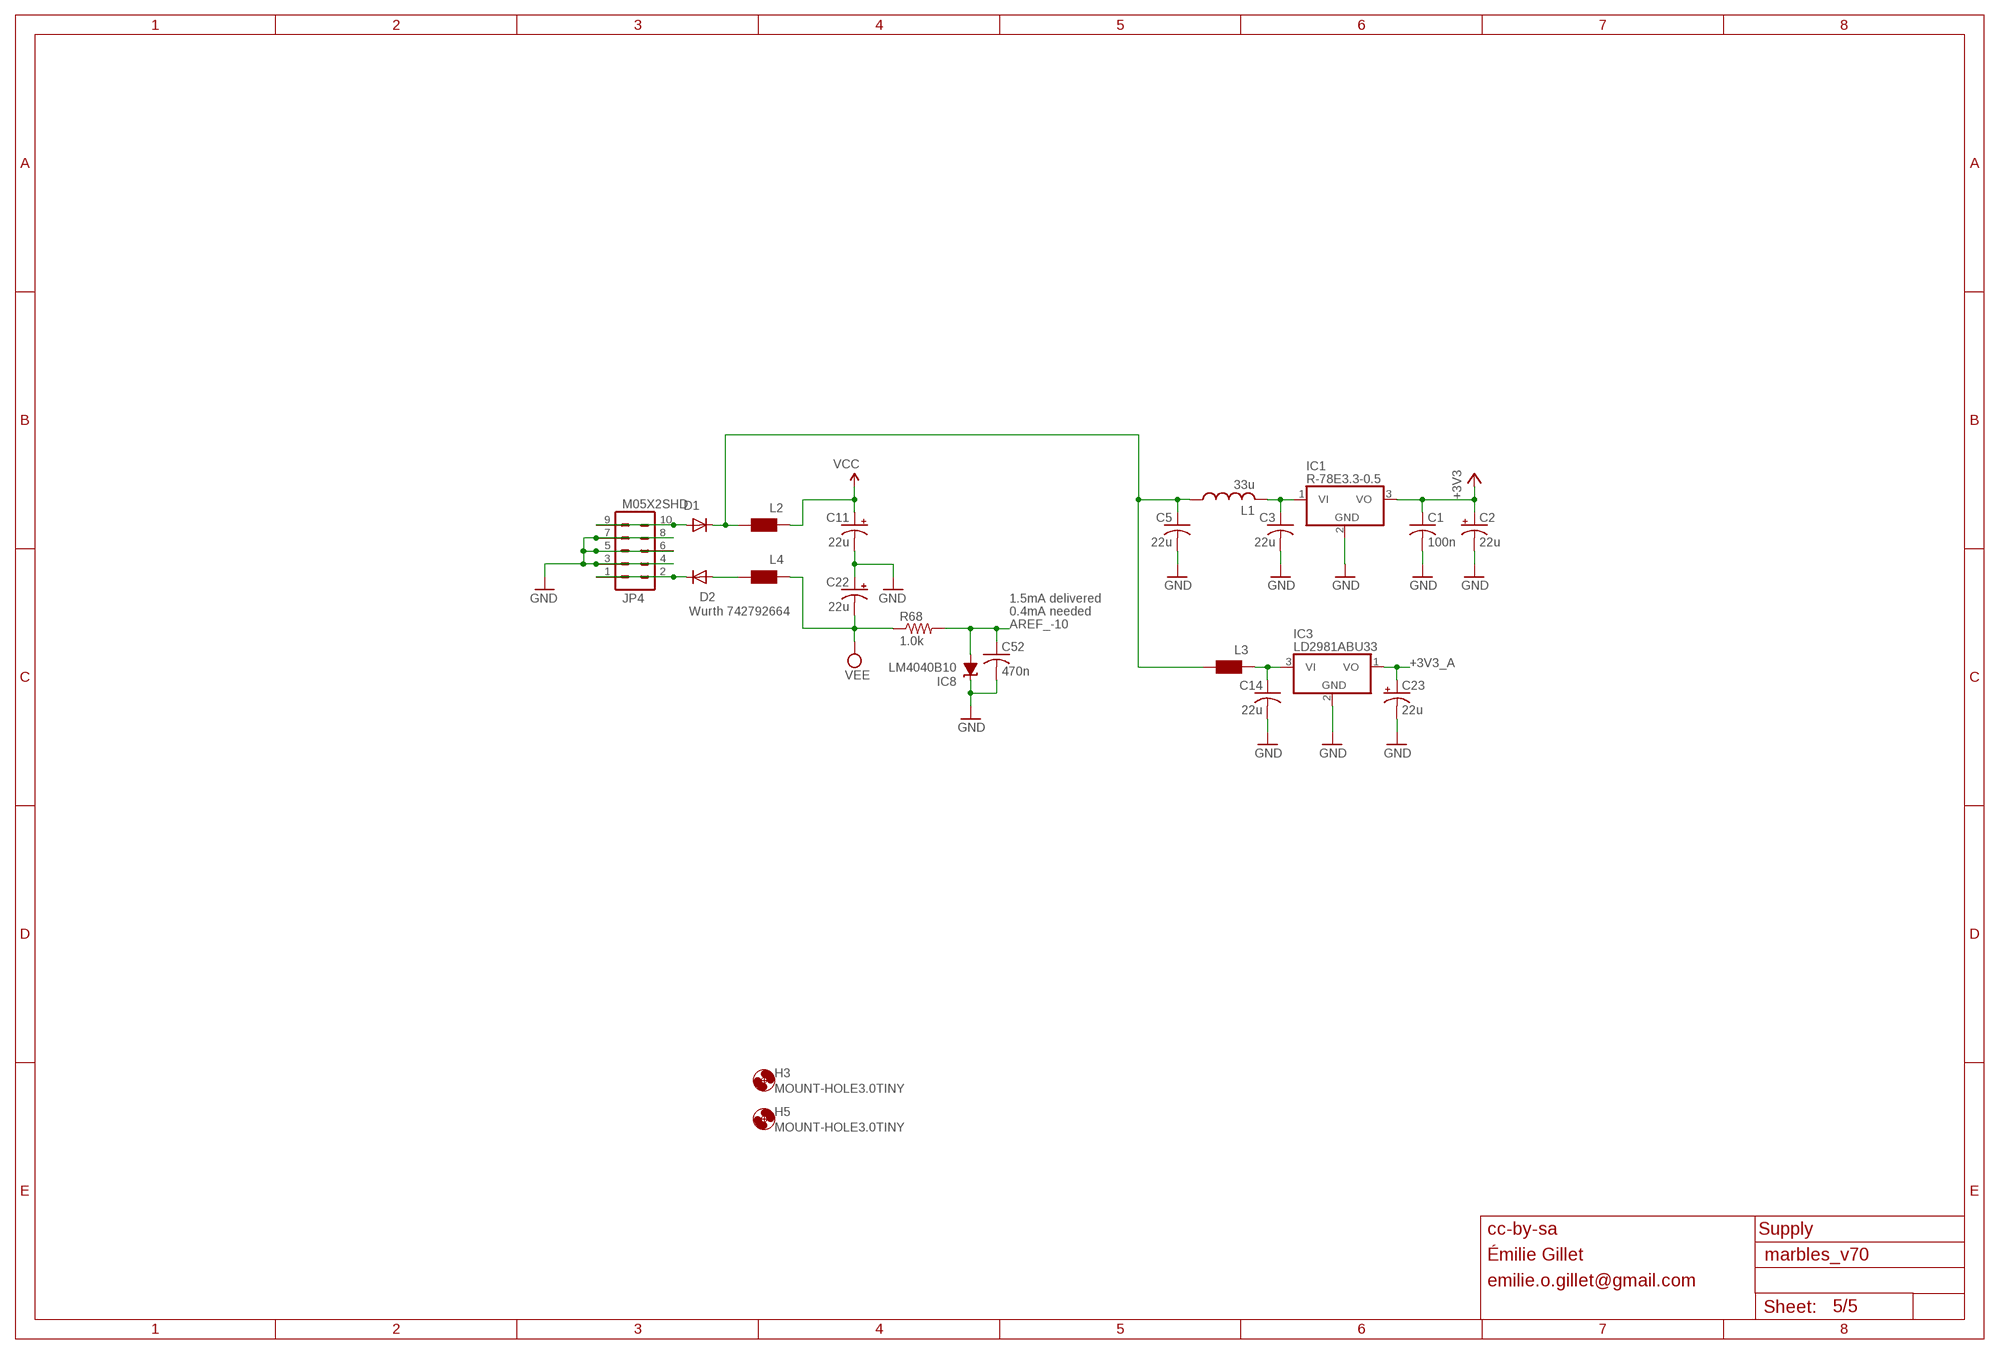
[diagram p4: schematic, sheet 5]

### Parts
C1  100n  C-USC0402  [C0402]
C2  22u  CPOL-USC  [PANASONIC_C]
C3  22u  C-USC1206  [C1206]
C5  22u  C-USC1206  [C1206]
C11  22u  CPOL-USC  [PANASONIC_C]
C14  22u  C-USC1206  [C1206]
C22  22u  CPOL-USC  [PANASONIC_C]
C23  22u  CPOL-USC  [PANASONIC_C]
C52  470n  C-USC0402  [C0402]
D1  1N5819HW  DIODE-SOD123  [SOD123]
D2  1N5819HW  DIODE-SOD123  [SOD123]
H3  MOUNT-HOLE3.0TINY  [3,0TINY]
H5  MOUNT-HOLE3.0TINY  [3,0TINY]
IC1  R-78E3.3-0.5  WE173950378  [WE78]
IC3  LD2981ABU33  LD2981ABU  [SOT89]
IC8  LM4040B10  LM4041B12DBZ  [DBZ_R-PDSO-G3]
JP4  M05X2SHD  [2X5-SHROUDED]
L1  33u  L-USL2012C  [L2012C]
L2  WE-CBF_0603  [0603]
L3  WE-CBF_0603  [0603]
L4  WE-CBF_0603  [0603]
R68  1.0k  R-US_R0402  [R0402]

### Nets
+3V3: C1.1 C2.+ IC1.3(VO) ; also sheet 1,3
+3V3_A: C23.+ IC3.1(VO) ; also sheet 1,2,3
AREF_-10: C52.1 IC8.2(A) R68.2 ; also sheet 3
GND: C1.2 C2.- C3.2 C5.2 C11.- C14.2 C22.+ C23.- C52.2 IC1.2(GND) IC3.2(GND) IC8.1(C) JP4.3 JP4.4 JP4.5 JP4.6 JP4.7 JP4.8 ; also sheet 1,2,3,4
N$4: C14.1 IC3.3(VI) L3.1
N$6: C5.1 D1.C L1.1 L2.2 L3.2
N$10: D2.A L4.2
N$32: C3.1 IC1.1(VI) L1.2
N$56: D1.A JP4.9 JP4.10
N$64: D2.C JP4.1 JP4.2
VCC: C11.+ L2.1 ; also sheet 4
VEE: C22.- L4.1 R68.1 ; also sheet 4

### Notes on the sheet
- 1.5mA delivered
- Wurth 742792664 | 0.4mA needed
- cc-by-sa | Supply
- Émilie Gillet
- emilie.o.gillet@gmail.com

## Library data of the parts
C1 C3-C10 C12-C21 C24-C26 C28-C58 = rcl:C-US: CAPACITOR, American symbol
C2 C11 C22 C23 C27 = rcl:CPOL-US: POLARIZED CAPACITOR, American symbol
D1 D2 D4 D5 = diode:DIODE-: DIODE
D3 = diode:DIODE_2CACA-: 2 Diodes - Cathode-Anode|Cathode-Anode
F1-F3 = SparkFun:FIDUCIAL: Fiducial Alignment Points Various fiducial points for machine vision alignment.
H3 H5 = og-holes:MOUNT-HOLE: MOUNTING HOLE with drill center marker
IC1 = og-vreg:WE173950378
IC2 = og-stm32f2:STM32F20X
IC3 = og-vreg:LD2981
IC4 = og-dac:DAC8564
IC5-IC7 IC9 IC10 = og-linear:TL074: OP AMP
IC8 = texas:LM4041: PRECISION MICROPOWER SHUNT VOLTAGE REFERENCE Source: http://focus.ti.com/lit/ds/slcs146e/slcs146e.pdf
J1-J16 = og-pj301:PJ301_THONKICONN
JP1 = SparkFun:M04: Header 4 Standard 4-pin 0.1" header. Use with straight break away headers (SKU : PRT-00116), right angle break away headers (PRT-00553), swiss pins (PRT-00743), machine pins (PRT-00117), and female headers (PRT-00115). Molex polarized connector foot print use with SKU : PRT-08231 with associated crimp pins and housings.
JP2 = SparkFun:M02: Header 2 Standard 2-pin 0.1" header. Use with straight break away headers (SKU : PRT-00116), right angle break away headers (PRT-00553), swiss pins (PRT-00743), machine pins (PRT-00117), and female headers (PRT-00115). Molex polarized connector foot print use with SKU : PRT-08233 with associated crimp pins and housings.
JP4 = og-header:M05X2: Header 5x2 Standard 10-pin dual row 0.1" header. Commonly used with AVR-ISP. Use with Spark Fun Electronics SKU: PRT-00778
L1 = og-rcl:L-US
L2-L4 = wuerth-elektronik:WE-CBF: SMD EMI Suppression Ferrite Beads - excellent anti-EMI properties - low DCR - impedances till 3000 ohms - rated current up to 6 A
LED1-LED5 = og-leds:LED-BICOLOR-THROUGHHOLE
LED6-LED12 = og-leds:LED-BICOLOR-SHARED-THROUGHHOLE
Q1 = og-crystal:CRYSTAL: Crystal with 2 extra terminals for the metal LID (Abracon ABMM2 for example)
Q2 Q3 = transistor:*-NPN-: NPN Transistror BF959 corrected 2008.03.06
R1-R3 R5-R12 R15 R17-R19 R22-R36 R39-R87 = rcl:R-US_: RESISTOR, American symbol
R4 R13 R14 R16 R20 R21 R37 R38 = og-pots:POT_US
SW1 SW2 = og-switch:LP4OA1PBCT
SW3-SW7 = SparkFun:TAC_SWITCH: Momentary Switch Button commonly used for reset or general input. Spark Fun Electronics SKU : COM-00097